# EAGLE design 003 (EAGLE 9.6.2)

## Sheet 1 of 2
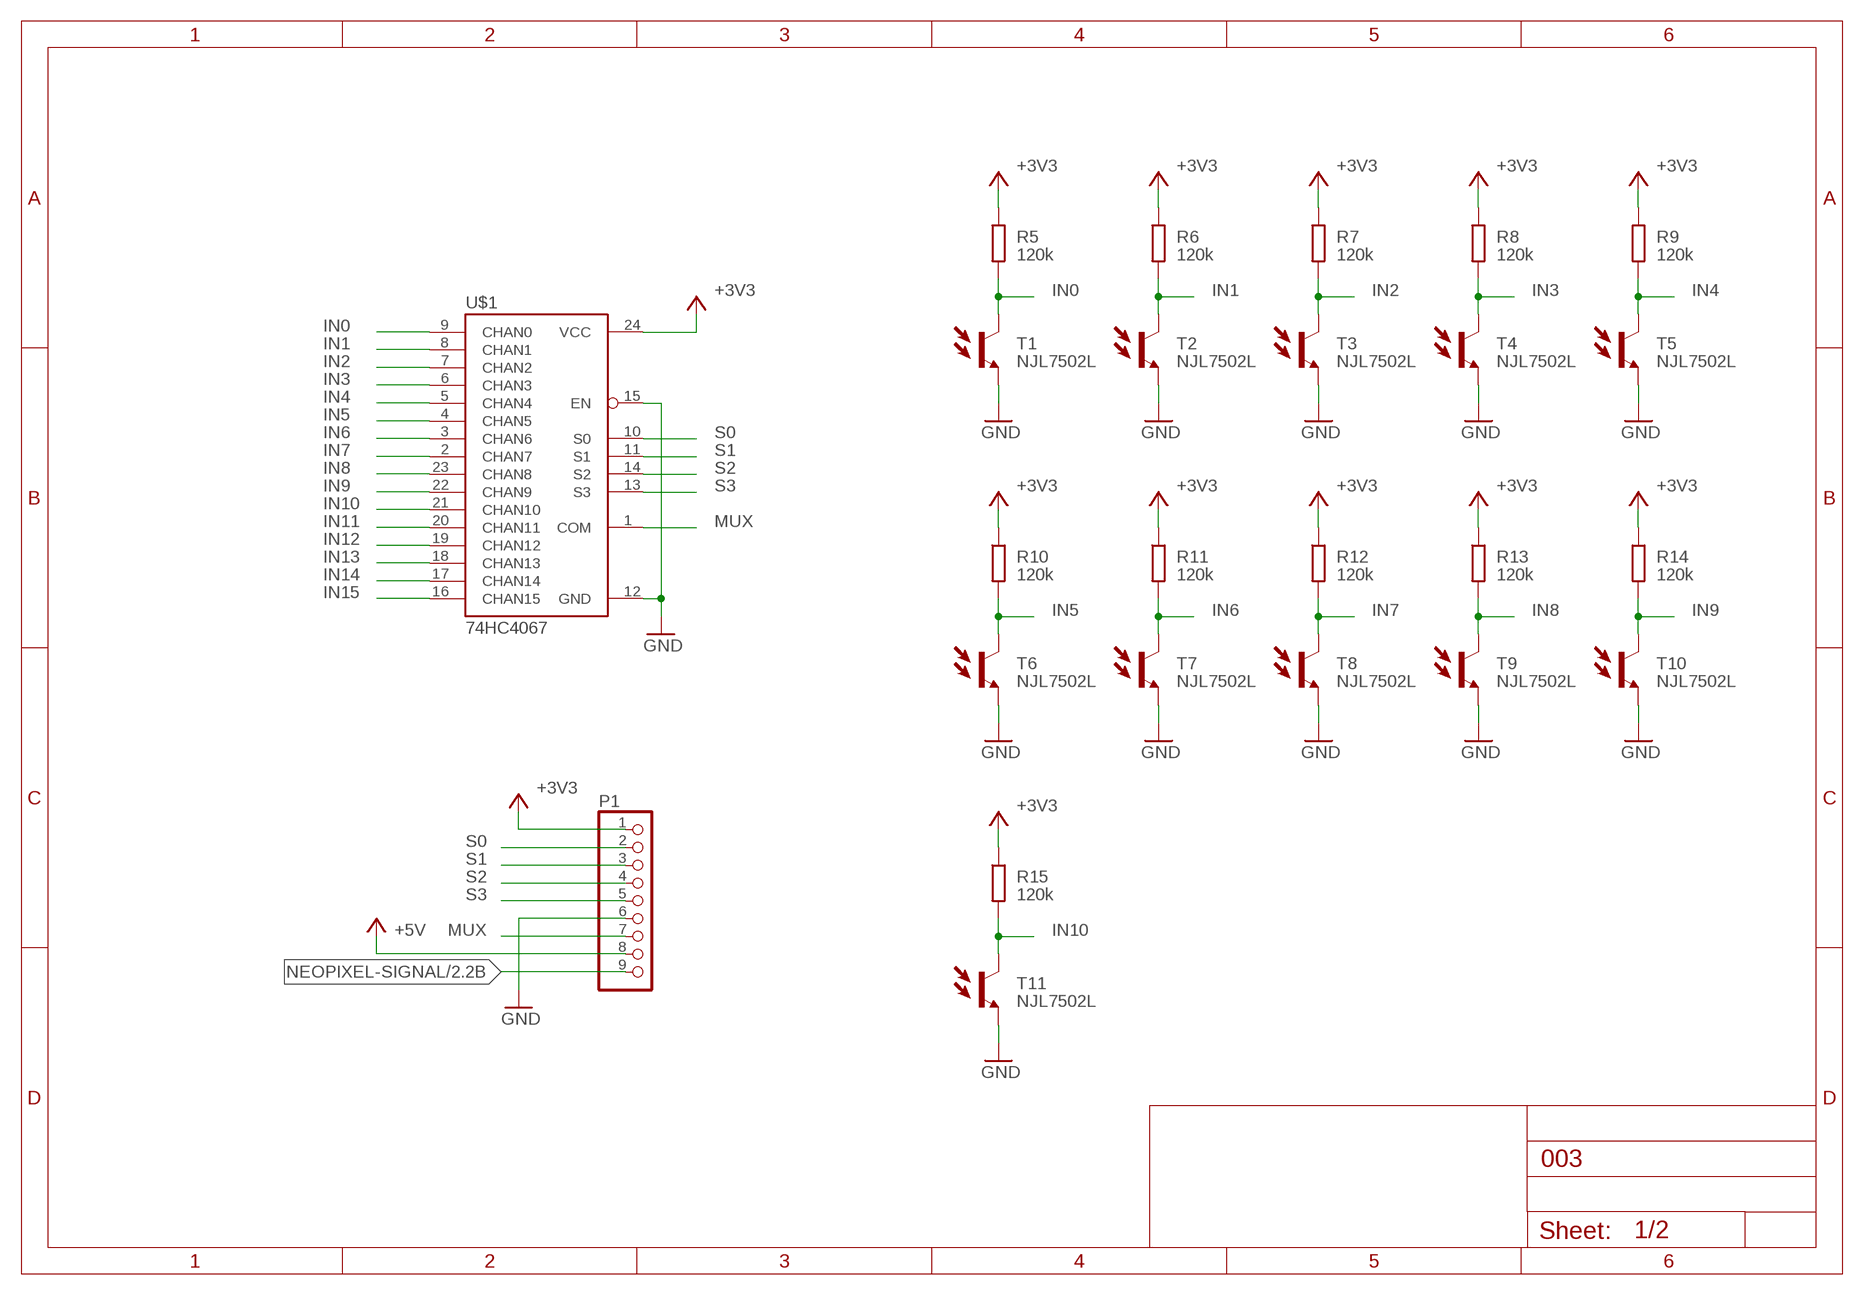
[diagram p0: schematic, sheet 1]

### Parts
P1  S9B-ZR-SM4A-TF  [ZH-SM4-SIDE09]
R5  120k  R-EU_R0805  [R0805]
R6  120k  R-EU_R0805  [R0805]
R7  120k  R-EU_R0805  [R0805]
R8  120k  R-EU_R0805  [R0805]
R9  120k  R-EU_R0805  [R0805]
R10  120k  R-EU_R0805  [R0805]
R11  120k  R-EU_R0805  [R0805]
R12  120k  R-EU_R0805  [R0805]
R13  120k  R-EU_R0805  [R0805]
R14  120k  R-EU_R0805  [R0805]
R15  120k  R-EU_R0805  [R0805]
T1  NJL7502L  MYPARTS_NJL7502L  [MYPARTS_NJL7502L]
T2  NJL7502L  MYPARTS_NJL7502L  [MYPARTS_NJL7502L]
T3  NJL7502L  MYPARTS_NJL7502L  [MYPARTS_NJL7502L]
T4  NJL7502L  MYPARTS_NJL7502L  [MYPARTS_NJL7502L]
T5  NJL7502L  MYPARTS_NJL7502L  [MYPARTS_NJL7502L]
T6  NJL7502L  MYPARTS_NJL7502L  [MYPARTS_NJL7502L]
T7  NJL7502L  MYPARTS_NJL7502L  [MYPARTS_NJL7502L]
T8  NJL7502L  MYPARTS_NJL7502L  [MYPARTS_NJL7502L]
T9  NJL7502L  MYPARTS_NJL7502L  [MYPARTS_NJL7502L]
T10  NJL7502L  MYPARTS_NJL7502L  [MYPARTS_NJL7502L]
T11  NJL7502L  MYPARTS_NJL7502L  [MYPARTS_NJL7502L]
U$1  74HC4067  SPARKFUN_MUX-74HC4067SMD  [SPARKFUN_SSOP24]

### Nets
+3V3: P1.1 R5.1 R6.1 R7.1 R8.1 R9.1 R10.1 R11.1 R12.1 R13.1 R14.1 R15.1 U$1.24(VCC)
+5V: P1.8 ; also sheet 2
GND: P1.6 T1.E T2.E T3.E T4.E T5.E T6.E T7.E T8.E T9.E T10.E T11.E U$1.12(GND) U$1.15(EN) ; also sheet 2
IN0: R5.2 T1.C U$1.9(CHAN0)
IN1: R6.2 T2.C U$1.8(CHAN1)
IN2: R7.2 T3.C U$1.7(CHAN2)
IN3: R8.2 T4.C U$1.6(CHAN3)
IN4: R9.2 T5.C U$1.5(CHAN4)
IN5: R10.2 T6.C U$1.4(CHAN5)
IN6: R11.2 T7.C U$1.3(CHAN6)
IN7: R12.2 T8.C U$1.2(CHAN7)
IN8: R13.2 T9.C U$1.23(CHAN8)
IN9: R14.2 T10.C U$1.22(CHAN9)
IN10: R15.2 T11.C U$1.21(CHAN10)
IN11: U$1.20(CHAN11)
IN12: U$1.19(CHAN12)
IN13: U$1.18(CHAN13)
IN14: U$1.17(CHAN14)
IN15: U$1.16(CHAN15)
MUX: P1.7 U$1.1(COM)
NEOPIXEL-SIGNAL: P1.9 ; also sheet 2
S0: P1.2 U$1.10(S0)
S1: P1.3 U$1.11(S1)
S2: P1.4 U$1.14(S2)
S3: P1.5 U$1.13(S3)

## Sheet 2 of 2: NeoPixels
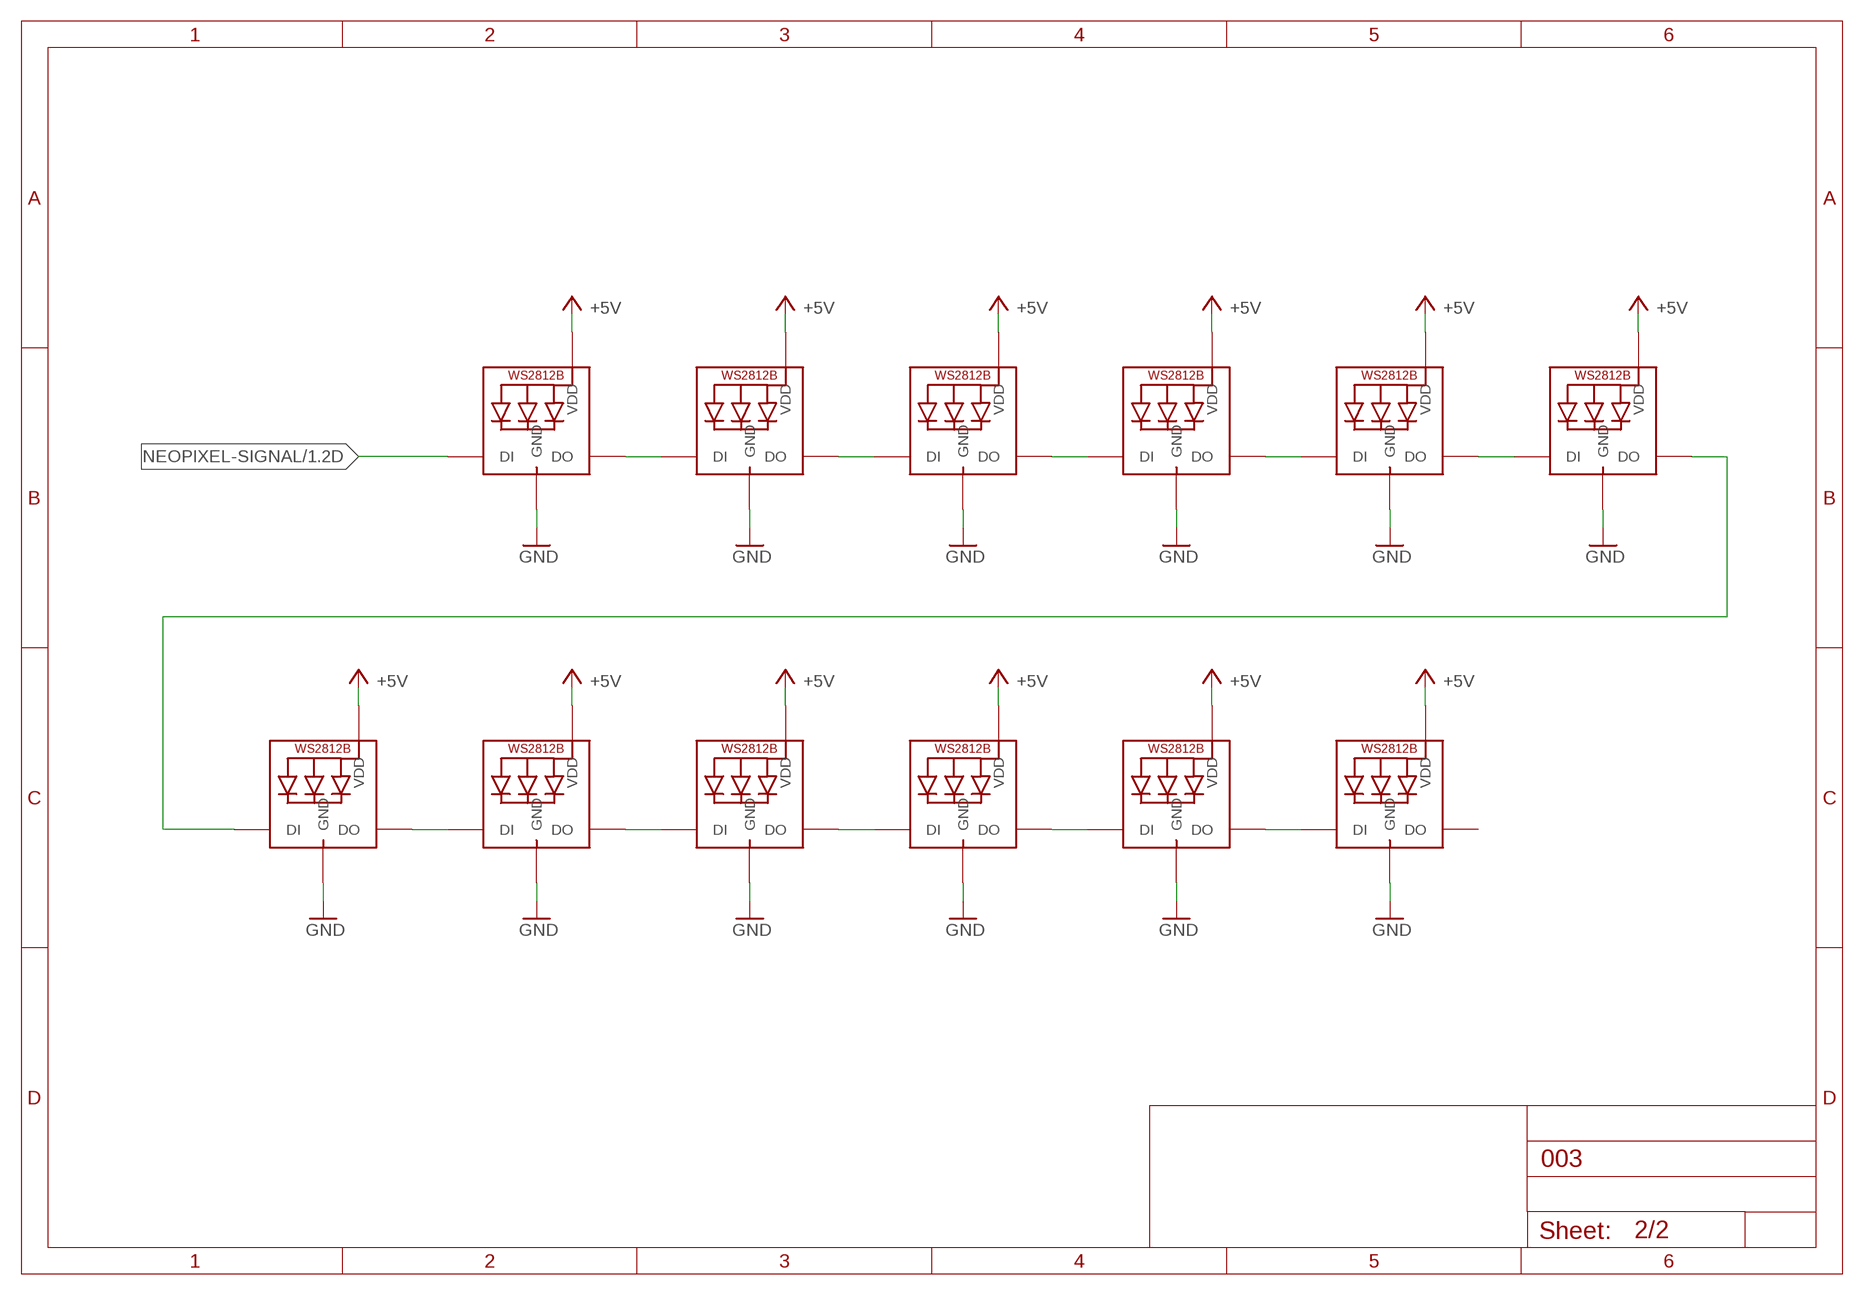
[diagram p1: schematic, sheet 2]

### Parts
LED1  WS2812B5050  [WS2812B]
LED2  WS2812B5050  [WS2812B]
LED3  WS2812B5050  [WS2812B]
LED4  WS2812B5050  [WS2812B]
LED5  WS2812B5050  [WS2812B]
LED6  WS2812B5050  [WS2812B]
LED7  WS2812B5050  [WS2812B]
LED8  WS2812B5050  [WS2812B]
LED9  WS2812B5050  [WS2812B]
LED10  WS2812B5050  [WS2812B]
LED11  WS2812B5050  [WS2812B]
LED12  WS2812B5050  [WS2812B]

### Nets
+5V: LED1.1-VDD(VDD) LED2.1-VDD(VDD) LED3.1-VDD(VDD) LED4.1-VDD(VDD) LED5.1-VDD(VDD) LED6.1-VDD(VDD) LED7.1-VDD(VDD) LED8.1-VDD(VDD) LED9.1-VDD(VDD) LED10.1-VDD(VDD) LED11.1-VDD(VDD) LED12.1-VDD(VDD) ; also sheet 1
GND: LED1.3-GND(GND) LED2.3-GND(GND) LED3.3-GND(GND) LED4.3-GND(GND) LED5.3-GND(GND) LED6.3-GND(GND) LED7.3-GND(GND) LED8.3-GND(GND) LED9.3-GND(GND) LED10.3-GND(GND) LED11.3-GND(GND) LED12.3-GND(GND) ; also sheet 1
N$1: LED2.2-DOUT(DO) LED3.4-DIN(DI)
N$2: LED1.2-DOUT(DO) LED2.4-DIN(DI)
N$3: LED3.2-DOUT(DO) LED4.4-DIN(DI)
N$4: LED4.2-DOUT(DO) LED5.4-DIN(DI)
N$5: LED5.2-DOUT(DO) LED6.4-DIN(DI)
N$6: LED6.2-DOUT(DO) LED7.4-DIN(DI)
N$7: LED7.2-DOUT(DO) LED8.4-DIN(DI)
N$8: LED8.2-DOUT(DO) LED9.4-DIN(DI)
N$9: LED9.2-DOUT(DO) LED10.4-DIN(DI)
N$10: LED10.2-DOUT(DO) LED11.4-DIN(DI)
N$11: LED11.2-DOUT(DO) LED12.4-DIN(DI)
NEOPIXEL-SIGNAL: LED1.4-DIN(DI) ; also sheet 1
Unconnected: LED12.2-DOUT(DO)

## Library data of the parts
LED1-LED12 = microbuilder:WS2812B
P1 = zh:S9B-ZR-SM4A-TF
R5-R15 = rcl:R-EU_: RESISTOR, European symbol; SPICEPREFIX: R
T1-T11 = #001-line:MYPARTS_NJL7502L
U$1 = Analog-Digital-Mux-Breakout:SPARKFUN_MUX-74HC4067

## Net classes
0 default: width 0.178 mm

## Board
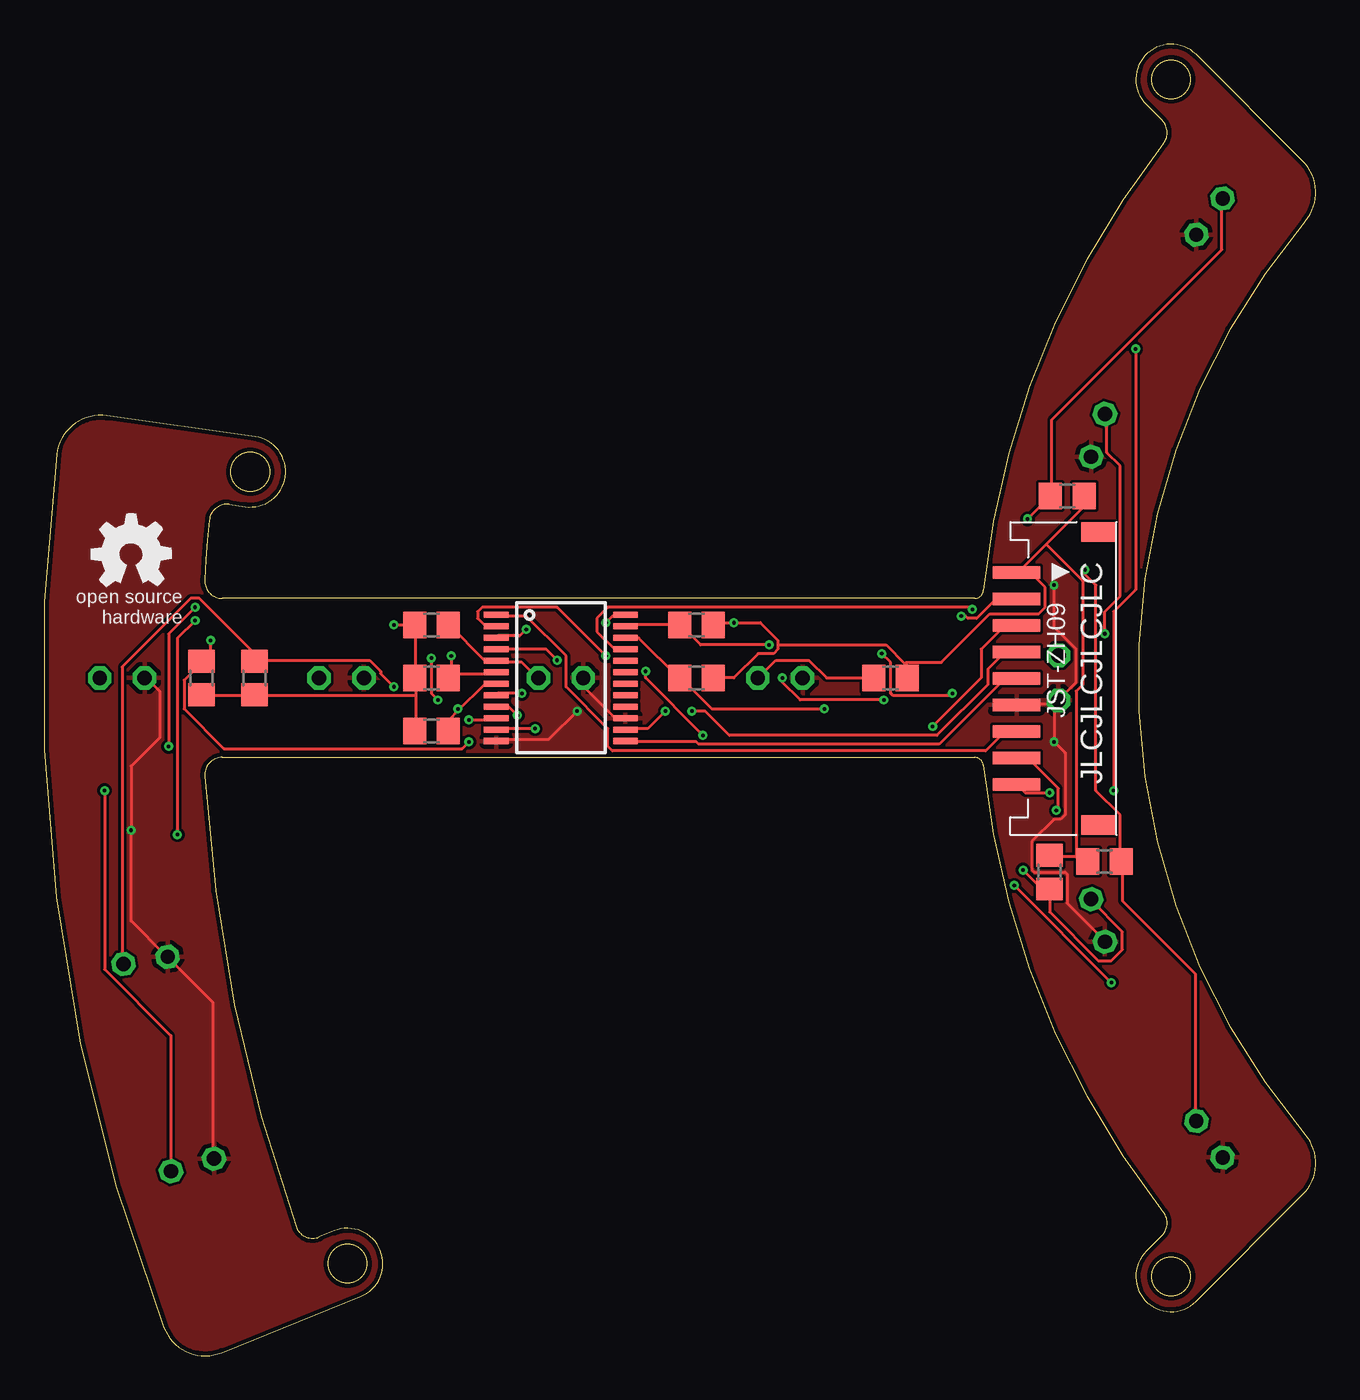
[diagram p2: board, top side]
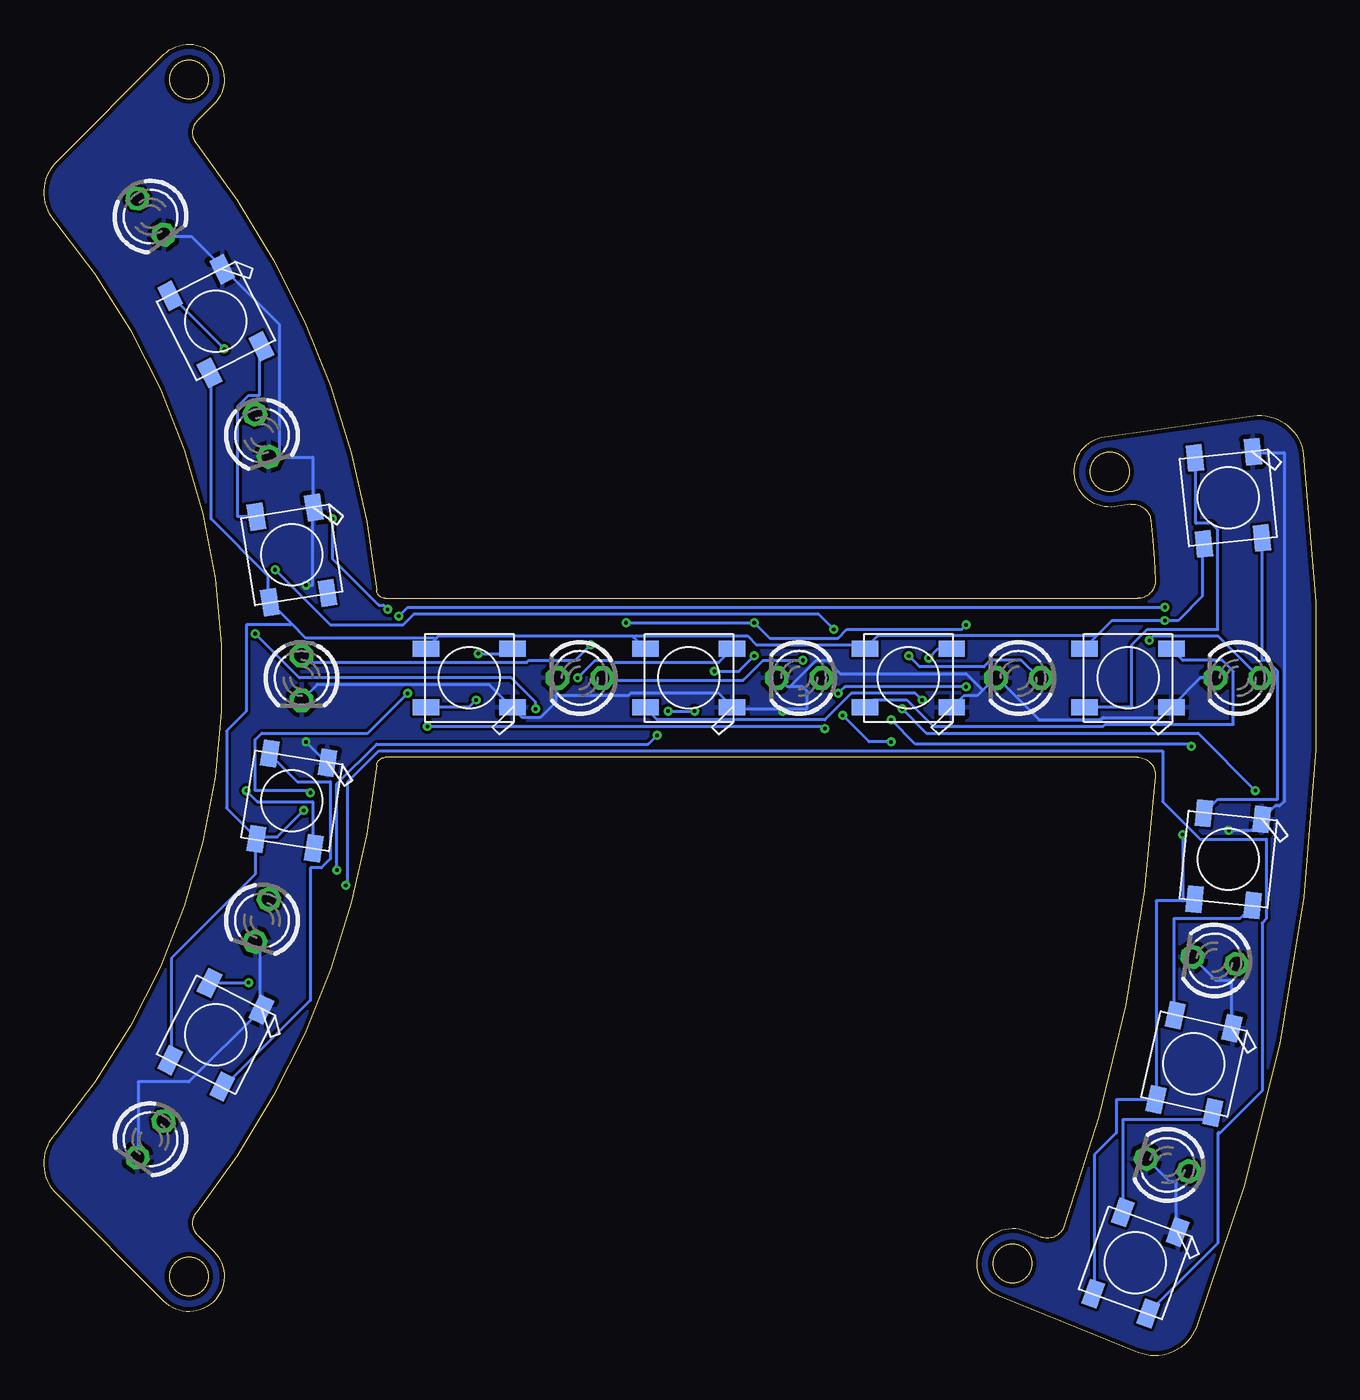
[diagram p3: board, bottom side, seen from below]

Size 71.99 x 74.26 mm. Coordinates in mm from the lower left corner, seen from the top.
Outline: 52.67,42.88 arc84 53.17,43.33
Outline: 53.17,43.33 arc-32 63.36,68.62 arc83 63.28,69.94 62.38,70.84 arc-180 65.21,73.67 71.26,67.62 arc-85 71.4,64.24 arc81 71.4,12.52 arc-85 71.26,9.14 65.21,3.09 arc-180 62.38,5.91 63.28,6.81 arc83 63.36,8.14 arc-32 53.17,33.43 arc84 52.67,33.88 10.08,33.88 arc93 9.08,32.82 arc16 14.26,7.32 arc92 15.57,6.73 16.43,7.07 arc-180 17.92,3.36 10.05,0.18 arc-91 6.78,1.6 arc-28 0.71,51.05 arc-91 3.54,53.21 11.95,52.03 arc-180 11.39,48.07 10.48,48.2 arc92 9.35,47.31 arc2 9.08,43.94 arc93 10.08,42.88 52.67,42.88
Outline: 52.67,42.88 arc84 53.17,43.33
Outline: circle at 17.18,5.22 radius 1.1
Outline: circle at 63.8,4.5 radius 1.1
Outline: circle at 11.67,50.05 radius 1.1
Outline: circle at 63.8,72.26 radius 1.1
Copper layers (1*16): Top 0.035mm / dielectric 1.5mm / Bottom 0.035mm
Design rules "SeeedStudio_2layer_DRU_no_angle_20140221 *": minimum track width 6mil, minimum drill 8mil, track to track 6mil, track to pad 6mil, pad to pad 6mil, via to via 6mil, smd to smd 0mil, copper to edge 10mil, drill to drill 10mil, minimum pad ring 10mil, minimum via ring 6mil, stop-mask expansion 2mil, vias tented up to drill 100mil, thermal gap 10mil

### Footprints (pad centres in the part's own frame; a part is rotated, then mirrored left to right if it is on the bottom)
WS2812B = smd 1.5 x 0.9: 1-VDD 2.45,-1.65; 2-DOUT 2.45,1.65; 3-GND -2.45,1.65; 4-DIN -2.45,-1.65
ZH-SM4-SIDE09 = smd 0.7 x 2.7: 1 -14.85,-5.65; 2 -13.35,-5.65; 3 -11.85,-5.65; 4 -10.35,-5.65; 5 -8.85,-5.65; 6 -7.35,-5.65; 7 -5.85,-5.65; 8 -4.35,-5.65; 9 -2.85,-5.65 | smd 1.1 x 1.9: P$1 -0.55,-1.05; P$2 -17.15,-1.05
R0805 = smd 1.3 x 1.5: 1 -0.95,0; 2 0.95,0
MYPARTS_NJL7502L = drill 0.813 octagon: C -1.27,0; E 1.27,0
SPARKFUN_SSOP24 = smd 0.348 x 1.397: 1 -3.575,-3.656; 2 -2.925,-3.656; 3 -2.275,-3.656; 4 -1.625,-3.656; 5 -0.975,-3.656; 6 -0.325,-3.656; 7 0.325,-3.656; 8 0.975,-3.656; 9 1.625,-3.656; 10 2.275,-3.656; 11 2.925,-3.656; 12 3.575,-3.656; 13 3.575,3.656; 14 2.925,3.656; 15 2.275,3.656; 16 1.625,3.656; 17 0.975,3.656; 18 0.325,3.656; 19 -0.325,3.656; 20 -0.975,3.656; 21 -1.625,3.656; 22 -2.275,3.656; 23 -2.925,3.656; 24 -3.575,3.656

### Placement (x,y rotation side)
LED1  47.92,38.38 180 bottom
LED2  35.49,38.38 180 bottom
LED3  23.06,38.38 180 bottom
LED4  10.63,38.38 180 bottom
LED5  4.95,48.57 276 bottom
LED6  4.96,28.11 263.9 bottom
LED7  6.9,16.53 257.1 bottom
LED8  10.22,5.26 250.1 bottom
LED9  62.27,18.18 243 bottom
LED10  57.97,31.42 261 bottom
LED11  62.27,58.58 297 bottom
LED12  57.97,45.34 279 bottom
P1  60.7,29.5 270 top
R5  8.92,38.38 90 top
R6  11.92,38.38 90 top
R7  21.92,35.38 0 top
R8  21.92,38.38 0 top
R9  21.92,41.38 0 top
R10  47.92,38.38 180 top
R11  60.02,27.98 0 top
R12  56.92,27.38 270 top
R13  36.92,41.38 180 top
R14  36.92,38.38 180 top
R15  57.92,48.68 180 top
T1  4.42,38.38 180 bottom
T2  5.74,22.38 170.6 bottom
T3  8.4,10.81 163.6 bottom
T4  16.84,38.38 180 bottom
T5  29.25,38.38 180 bottom
T6  41.67,38.38 180 bottom
T7  65.97,12.26 234 bottom
T8  59.66,24.65 252 bottom
T9  57.42,38.38 270 bottom
T10  59.66,52.11 288 bottom
T11  65.97,64.5 306 bottom
U$1  29.25,38.38 270 top
U$2  [OSHW_5MM]  4.92,45.38 0 top

### Tracks (layer width: path | path; a pad name or v marks a point on that pad's centre or on a via)
+3V3  (via drill 0.2)
  Top 0.178: 58.42,28.25 58.79,28.25 R11.1 | 58.42,28.25 56.92,28.25 R12.1 | 56.73,45.94 55.17,44.38 P1.1 55.54,44.63 56.67,43.5 56.67,42.38 56.29,42 53.54,42 50.79,39.25 48.79,39.25 48.73,39.19 | 56.73,45.94 58.79,48 58.79,48.63 R15.1 | 58.42,28.25 58.42,37.63 58.79,38 58.79,43.88 56.73,45.94 | 11.92,37.38 8.92,37.38 R5.1 | 21.04,38.38 21.04,37.38 | 21.04,37.38 21.04,35.38 R7.1 | 21.04,38.38 21.04,41.38 R9.1 v19.79,41.38 | 21.04,38.38 R8.1 | 21.04,37.38 11.92,37.38 | 11.92,37.38 R6.1 | v31.79,41.5 32.17,41.88 32.79,41.88 U$1.24 | R13.1 37.92,41.38 38.04,41.5 v39.04,41.5 40.54,41.5 41.54,40.5 41.54,40.25 | R14.1 39.04,38.38 40.42,39.75 41.29,39.75 41.54,40 41.54,40.25 | 48.73,39.19 47.67,40.25 41.54,40.25 | 48.73,39.19 48.79,39.13 48.79,38.38 R10.1
  Bottom 0.178: v39.04,41.5 v31.79,41.5 30.92,40.63 27.04,40.63 26.54,41.13 20.04,41.13 v19.79,41.38
+5V  (via drill 0.2)
  Top 0.178: v57.29,30.88 57.42,31 57.42,32.13 55.79,33.75 55.17,33.75 P1.8 | v7.54,29.5 7.54,40.63 v8.54,41.63
  Bottom 0.178: LED9.1-VDD 64.79,16.75 64.79,22.5 60.04,27.25 60.04,29.25 LED10.1-VDD | v57.29,30.88 58.79,29.38 59.92,29.38 LED10.1-VDD | 7.54,25.75 6.92,25.75 LED6.1-VDD | 7.54,25.75 9.04,25.75 9.04,14.63 LED7.1-VDD 9.17,14.5 11.29,14.5 11.29,12.63 12.54,11.38 12.54,3.63 LED8.1-VDD | 12.48,40.69 11.54,41.63 v8.54,41.63 7.79,41.63 6.42,43 6.42,45.88 LED5.1-VDD | 12.48,40.69 13.04,40.13 LED4.1-VDD | 12.48,40.69 12.54,40.75 24.79,40.75 25.42,40.13 LED3.1-VDD 25.54,40.13 25.67,40.25 31.67,40.25 32.17,40.75 38.54,40.75 38.61,40.69 | 38.61,40.69 38.67,40.75 49.67,40.75 49.86,40.57 | 38.61,40.69 38.04,40.13 LED2.1-VDD | 49.86,40.57 50.29,40.13 LED1.1-VDD | 57.98,41.44 57.17,40.63 49.92,40.63 49.86,40.57 | 57.98,41.44 59.17,42.63 LED12.1-VDD 59.29,42.75 59.29,44.13 62.54,47.38 62.54,55.63 LED11.1-VDD | v7.54,29.5 7.54,25.75 | LED10.1-VDD 60.04,29.38 61.67,31 61.67,35.38 60.54,36.5 60.54,41.38 58.04,41.38 57.98,41.44
GND  (via drill 0.2)
  Top 0.178: T3.E 9.54,11.25 9.54,20 7.04,22.5 T2.E 6.92,22.63 4.92,24.63 v4.92,29.75 4.92,33.38 6.54,35 6.54,37.63 5.79,38.38 T1.E | T9.E 57.42,37 57.17,36.75 v57.17,34.75 57.79,34.13 57.79,30.63 57.54,30.38 57.17,30.38 55.92,29.13 55.92,27.5 56.04,27.38 57.79,27.38 57.92,27.25 57.92,25.63 60.04,23.5 T8.E | P1.6 55.17,36.88 57.17,36.88 T9.E | U$1.15 32.79,36.13 32.29,36.13 30.54,37.88 30.54,38.38 T5.E | v30.17,36.5 28.54,34.88 25.67,34.88 U$1.12 | v57.17,43.63 57.17,41.25 58.42,40 58.42,38.13 57.42,37.13 T9.E
  Bottom 0.178: LED5.3-GND 3.54,51.13 1.79,51.13 1.79,31.38 2.04,31.13 2.29,31.13 3.04,30.38 LED6.3-GND 3.17,30.25 3.67,29.75 v4.92,29.75 | LED8.3-GND 7.92,7.13 7.92,9.88 8.29,9.88 9.54,11.13 T3.E | LED7.3-GND 4.79,18.63 4.79,21.25 5.67,21.25 6.92,22.5 T2.E | T11.E 65.17,63.38 63.67,63.38 61.92,61.63 LED11.3-GND 61.79,61.5 58.67,58.38 58.67,50.88 | 58.67,50.88 59.17,50.88 T10.E 58.67,50.88 | 58.67,50.88 56.79,50.88 56.79,48.13 LED12.3-GND 56.79,48 56.79,43.63 v57.17,43.63 | T8.E 60.04,23.38 59.79,23.38 59.79,19.63 LED9.3-GND 59.79,19.5 63.79,15.5 66.67,15.5 66.67,11.25 T7.E | T1.E 6.54,38.38 8.17,36.75 LED4.3-GND 8.29,36.63 8.79,36.13 12.04,36.13 12.17,36 15.67,36 18.04,38.38 T4.E 18.17,38.38 18.86,37.69 | 18.86,37.69 19.17,37.38 19.92,37.38 20.54,36.75 LED3.3-GND | v57.17,34.75 56.04,33.63 LED10.3-GND | 43.04,37.38 43.04,38.38 T6.E | 43.04,37.38 43.04,37 43.92,36.13 44.92,36.13 45.42,36.63 LED1.3-GND 45.54,36.75 46.79,38 56.54,38 57.42,37.13 T9.E | 43.04,37.38 38.92,37.38 38.79,37.5 33.79,37.5 33.04,36.75 LED2.3-GND 32.92,36.63 30.29,36.63 v30.17,36.5 30.17,36.63 28.79,36.63 28.79,37.63 29.04,37.88 29.79,37.88 | 29.79,37.88 29.92,37.88 30.42,38.38 T5.E | 18.86,37.69 19.79,38.63 26.92,38.63 27.67,39.38 28.29,39.38 29.79,37.88
  pour Top: 72.92,75.38 72.92,-0.62 -1.08,-0.62 -1.08,75.38
  pour Bottom: 72.92,75.38 72.92,-0.62 -1.08,-0.62 -1.08,75.38
IN0  (via drill 0.2)
  Top 0.178: U$1.9 26.29,36.75 v26.79,36.25 | v24.04,34.75 23.67,34.38 10.17,34.38 7.92,36.63 7.92,38.25 8.92,39.25 R5.2 8.92,39.38 9.42,39.88 v9.42,40.5
  Bottom 0.178: v26.79,36.25 25.29,34.75 v24.04,34.75 | v9.42,40.5 9.17,40.75 5.54,40.75 3.17,38.38 T1.C
IN1  (via drill 0.2)
  Top 0.178: v27.04,37.5 25.67,37.5 U$1.8 | v19.79,37.88 19.04,38.63 19.04,38.75 18.42,39.38 12.29,39.38 | 12.29,39.38 11.92,39.38 R6.2 12.29,39.38 | 12.29,39.38 8.79,42.88 8.29,42.88 4.42,39 4.42,22.25 T2.C
  Bottom 0.178: v27.04,37.5 26.67,37.88 v19.79,37.88
IN2  (via drill 0.2)
  Top 0.178: 23.48,36.57 22.92,36 22.92,35.38 R7.2 | 23.48,36.57 24.92,38 25.54,38 U$1.7 | v3.42,32 3.42,21.88 7.17,18.13 7.17,10.5 T3.C | v23.42,36.63 23.48,36.57
  Bottom 0.178: v3.42,32 6.67,35.25 22.04,35.25 v23.42,36.63
IN3  (via drill 0.2)
  Top 0.178: U$1.6 25.54,38.63 23.17,38.63 22.92,38.38 R8.2 23.04,38.63 v23.04,39.63
  Bottom 0.178: v23.04,39.63 22.42,39 18.79,39 18.42,39.38 16.67,39.38 15.67,38.38 T4.C
IN4
  Top 0.178: T5.C 27.92,38.38 27.04,39.25 25.67,39.25 U$1.5 25.54,39.38 24.92,39.38 22.92,41.38 R9.2
IN5  (via drill 0.2)
  Top 0.178: U$1.4 28.42,40 v29.04,39.38 | R10.2 44.29,38.38 43.29,39.38 41.42,39.38 40.42,38.38 T6.C
  Bottom 0.178: v29.04,39.38 31.29,39.38 32.42,38.25 40.17,38.25 40.29,38.38 T6.C
IN6  (via drill 0.2)
  Top 0.178: v27.29,41.13 26.92,40.75 25.67,40.75 U$1.3 | v58.92,44.5 58.92,44.25 59.54,43.63 59.54,32 60.92,30.63 60.92,28 R11.2 61.04,27.88 61.04,25.75 65.17,21.63 65.17,13.38 T7.C
  Bottom 0.178: v27.29,41.13 28.17,42 51.04,42 51.67,41.38 55.79,41.38 v58.92,44.5
IN7  (via drill 0.2)
  Top 0.178: v31.79,39.63 29.04,42.38 24.79,42.38 24.54,42.13 24.54,41.75 24.92,41.38 25.54,41.38 U$1.2 | v34.04,38.75 34.04,38.38 v37.29,35.13 | v55.42,27.5 56.42,26.5 56.92,26.5 R12.2 56.92,25.13 59.67,22.38 60.42,22.38 61.04,23 61.04,24 59.29,25.75 T8.C
  Bottom 0.178: v31.79,39.63 32.67,38.75 v34.04,38.75 | v37.29,35.13 37.79,34.63 53.17,34.63 55.42,32.38 v55.42,27.5
IN8  (via drill 0.2)
  Top 0.178: U$1.23 32.92,41.38 R13.2 36.04,41.38 37.17,40.25 v41.04,40.25
  Bottom 0.178: v41.04,40.25 41.92,39.38 44.54,39.38 44.67,39.25 57.04,39.25 57.42,39.63 T9.C
IN9  (via drill 0.2)
  Top 0.178: U$1.22 32.92,40.63 33.67,40.63 35.92,38.38 R14.2 36.04,38.38 37.79,36.63 v44.17,36.63 | v60.04,40.88 60.04,42.13 60.92,43 60.92,50.38 60.17,51.13 60.17,53.25 T10.C
  Bottom 0.178: v60.04,40.88 57.54,38.38 45.54,38.38 44.17,37 v44.17,36.63
IN10  (via drill 0.2)
  Top 0.178: U$1.21 32.29,40 31.29,41 31.29,41.75 31.92,42.38 52.42,42.38 v52.54,42.25 | v55.67,47.38 R15.2 57.04,48.75 57.04,53 66.67,62.63 66.67,65.5 T11.C
  Bottom 0.178: v52.54,42.25 52.79,42.5 53.04,42.5 55.67,45.13 v55.67,47.38
MUX
  Top 0.178: U$1.1 25.67,41.88 27.29,41.88 29.54,39.63 29.54,37.88 31.92,35.5 31.92,34.5 32.17,34.25 53.29,34.25 54.29,35.25 55.04,35.25 P1.7
N$1  (via drill 0.2)
  Top 0.178: v22.29,37.13 21.92,37.5 v21.92,39.5
  Bottom 0.178: v22.29,37.13 22.67,37.5 26.29,37.5 27.79,36 37.29,36 37.92,36.63 LED2.2-DOUT | v21.92,39.5 21.42,40 20.67,40 LED3.4-DIN
N$2  (via drill 0.2)
  Top 0.178: v41.79,38.38 41.79,38.13 42.79,37.13 v47.54,37.13
  Bottom 0.178: v41.79,38.38 40.79,39.38 40.04,39.38 39.92,39.25 33.79,39.25 33.04,40 LED2.4-DIN | v47.54,37.13 47.92,36.75 50.29,36.75 LED1.2-DOUT
N$3
  Bottom 0.178: LED4.4-DIN 8.17,40 7.54,39.38 5.29,39.38 4.67,38.75 4.67,35.75 11.92,35.75 12.04,35.63 21.67,35.63 23.17,37.13 25.04,37.13 25.42,36.75 LED3.2-DOUT
N$4
  Bottom 0.178: LED5.4-DIN 6.79,50.75 6.79,47.13 5.92,47.13 5.54,46.75 5.54,41.13 9.54,41.13 10.42,40.25 10.42,36.75 13.04,36.75 LED4.2-DOUT
N$5
  Bottom 0.178: LED5.2-DOUT 3.04,46.25 3.04,39.38 2.79,39.38 2.17,38.75 2.17,31.5 5.54,31.5 6.29,30.75 LED6.4-DIN
N$6
  Bottom 0.178: LED7.4-DIN 8.04,19.38 8.04,24.75 4.29,24.75 3.67,25.38 LED6.2-DOUT
N$7
  Bottom 0.178: LED8.4-DIN 10.92,13.38 6.29,13.38 5.92,13.75 LED7.2-DOUT
N$8  (via drill 0.2)
  Top 0.178: v60.42,21.13 v54.92,26.63
  Bottom 0.178: v54.92,26.63 54.79,26.63 54.79,32.5 53.04,34.25 8.67,34.25 8.67,31.38 6.54,29.25 2.79,29.25 2.79,24.75 3.04,24.5 3.04,15 5.42,12.63 5.54,12.63 5.54,6.38 9.42,2.5 LED8.2-DOUT | v60.42,21.13 62.54,21.13 LED9.4-DIN
N$9
  Bottom 0.178: LED9.2-DOUT 61.79,15.25 56.92,20.13 56.92,27.63 56.29,27.63 55.79,28.13 55.79,32.5 57.67,32.5 59.17,34 LED10.4-DIN
N$10  (via drill 0.2)
  Top 0.178: v60.54,32 60.54,42.13 61.79,43.38 v61.79,57
  Bottom 0.178: v60.54,32 59.92,31.38 56.79,31.38 56.79,28.75 LED10.2-DOUT | v61.79,57 64.79,60 LED11.4-DIN
N$11
  Bottom 0.178: LED11.2-DOUT 59.79,57.13 59.79,54.38 60.42,54.38 61.04,53.75 61.04,47.5 60.04,47.5 LED12.4-DIN
NEOPIXEL-SIGNAL  (via drill 0.2)
  Top 0.178: v47.42,39.75 47.92,39.25 47.92,37.5 48.04,37.38 51.29,37.38 v51.42,37.5 | v56.92,31.88 55.54,31.88 55.17,32.25 P1.9
  Bottom 0.178: v47.42,39.75 45.79,39.75 45.54,40 LED1.4-DIN | v51.42,37.5 53.67,35.25 59.67,35.25 60.04,34.88 60.04,32 57.04,32 v56.92,31.88
S0  (via drill 0.2)
  Top 0.178: v24.04,36 25.54,36 U$1.10 | v7.04,34.5 7.04,40.88 v8.54,42.38 | v51.92,41.88 52.17,41.88 52.29,41.75 52.79,41.75 53.79,42.75 55.04,42.75 P1.2
  Bottom 0.178: v24.04,36 22.67,34.63 7.17,34.63 v7.04,34.5 | v8.54,42.38 51.42,42.38 v51.92,41.88
S1  (via drill 0.2)
  Top 0.178: v27.79,35.5 25.67,35.5 U$1.11 | v50.29,35.63 53.04,38.38 53.04,40 54.29,41.25 55.04,41.25 P1.3
  Bottom 0.178: v27.79,35.5 27.92,35.63 v50.29,35.63
S2  (via drill 0.2)
  Top 0.178: v35.17,36.5 34.17,35.5 32.92,35.5 U$1.14 | v36.67,36.5 37.42,36.5 38.79,35.13 50.54,35.13 53.42,38 53.42,38.88 54.29,39.75 55.04,39.75 P1.4
  Bottom 0.178: v36.67,36.5 v35.17,36.5
S3
  Top 0.178: U$1.13 32.92,34.75 36.92,34.75 37.04,34.63 50.67,34.63 54.29,38.25 55.04,38.25 P1.5

### Text on the board
tPlace: JLCJLCJLCJLC